# Altium schematic sheet 1050.SchDoc
size A3
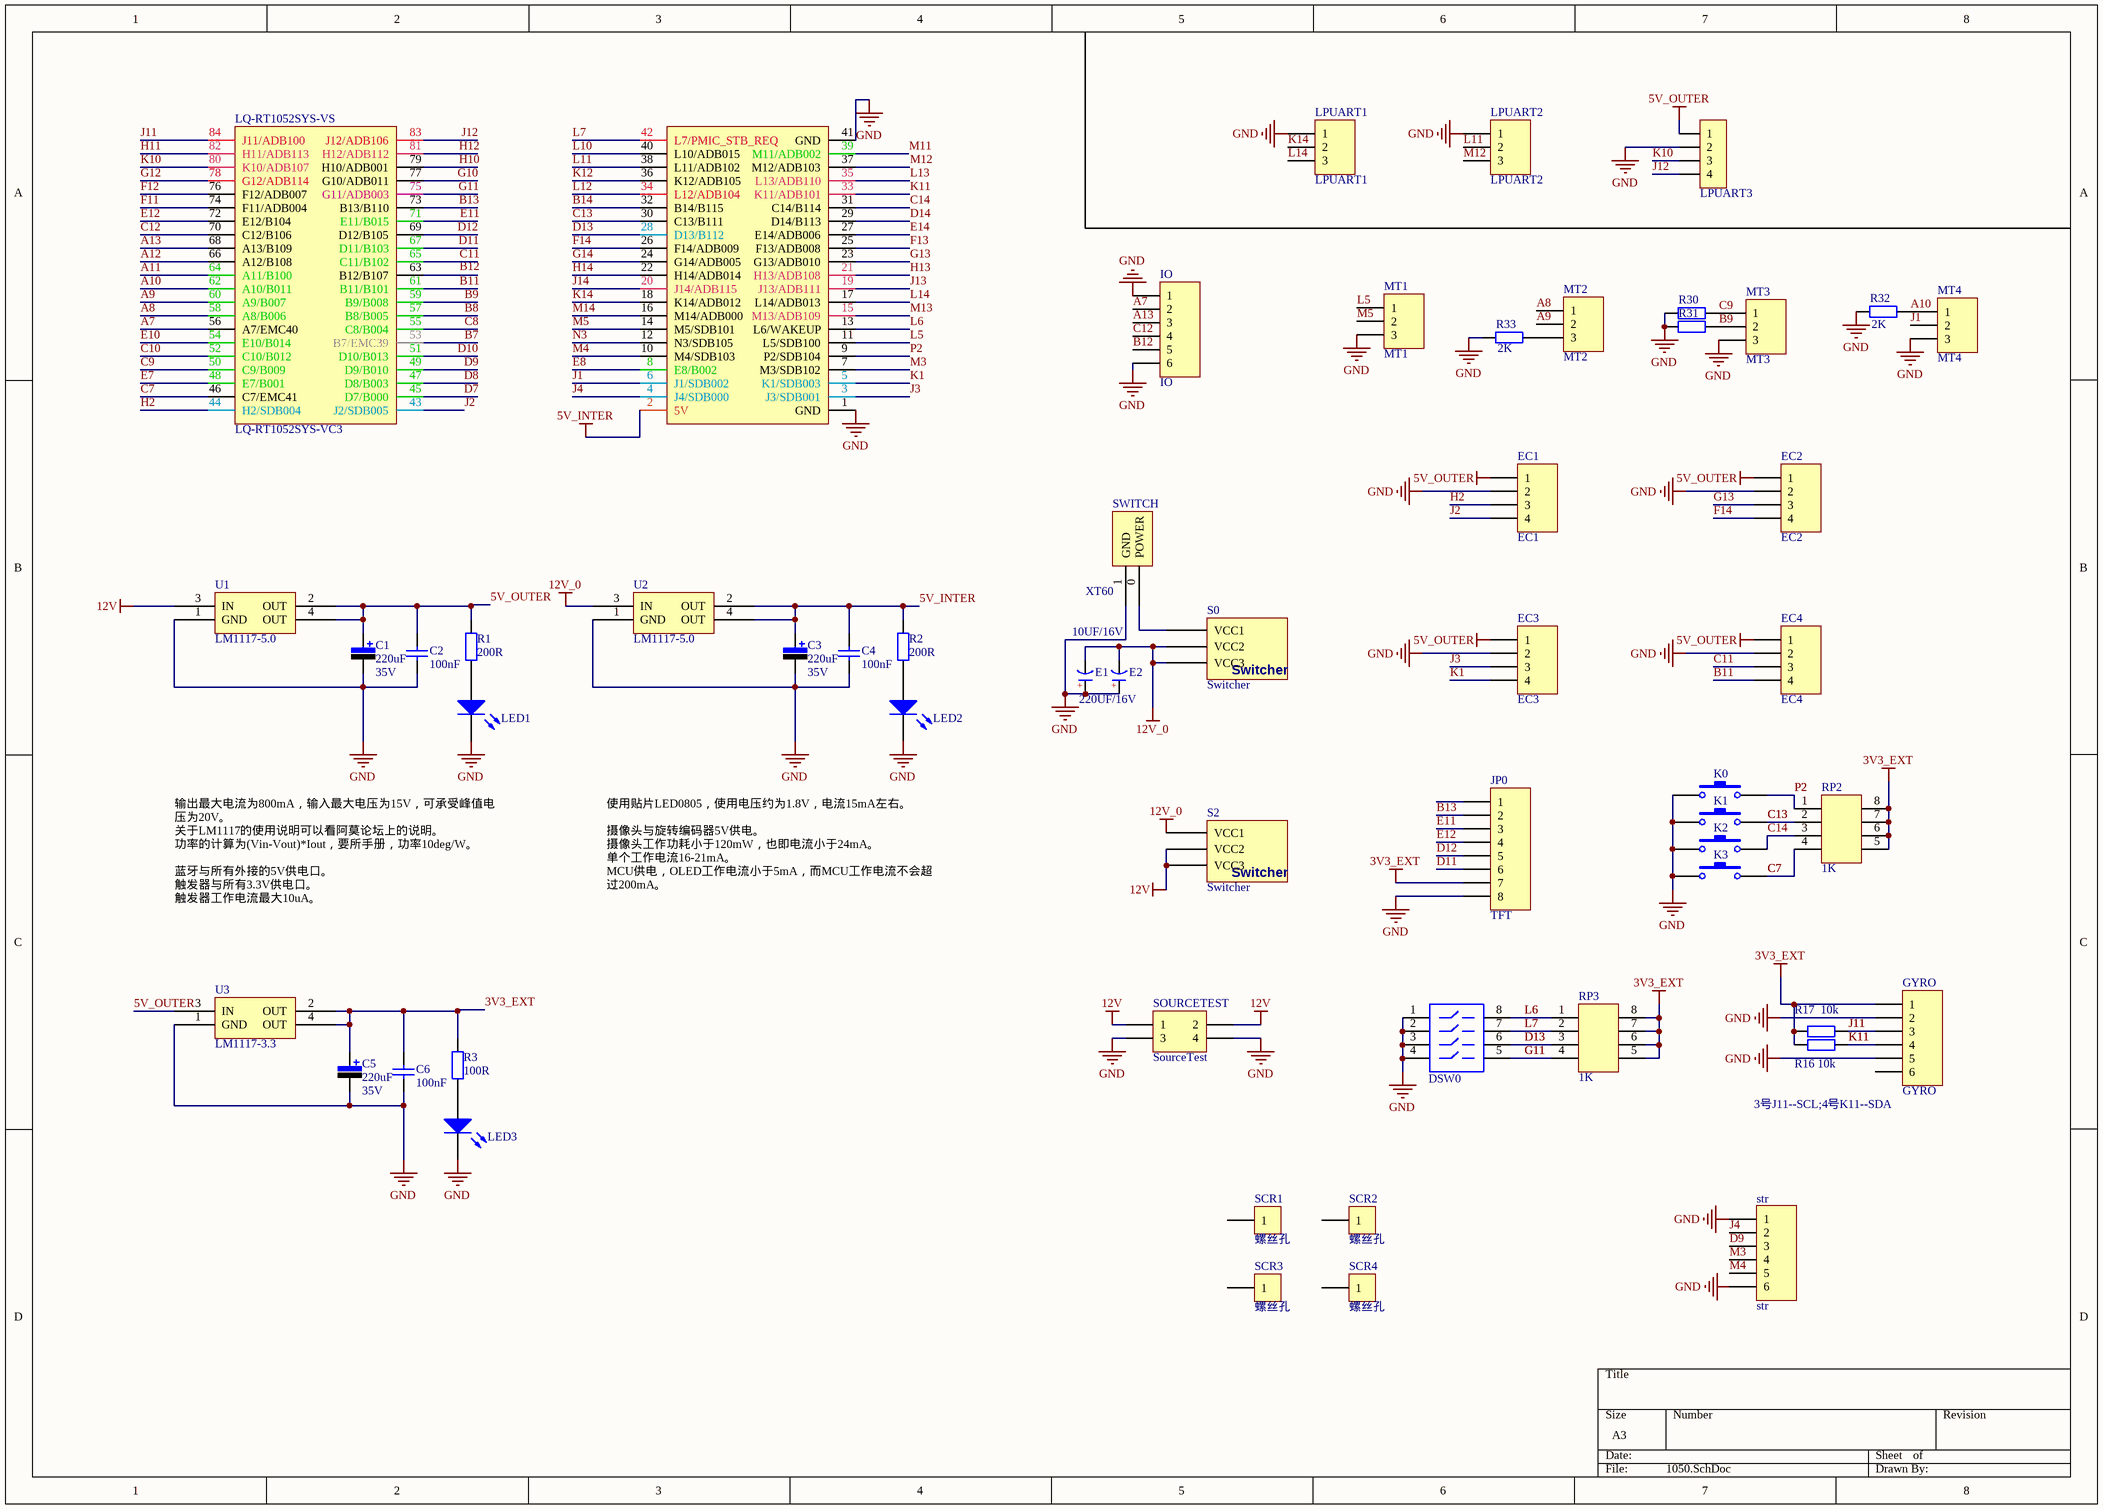
[diagram p0: 1050.SchDoc]

## Parts
C1  value 220uF  Vol: 35V  [CAP-7343]  (hidden comment: Cap Pol)
C2  value 100nF  [C 0805]  (hidden comment: Cap)
C3  value 220uF  Vol: 35V  [CAP-7343]  (hidden comment: Cap Pol)
C4  value 100nF  [C 0805]  (hidden comment: Cap)
C5  value 220uF  Vol: 35V  [CAP-7343]  (hidden comment: Cap Pol)
C6  value 100nF  [C 0805]  (hidden comment: Cap)
DSW0  SW-DIP4  [LQ_DIP-4-KEY]  (value not drawn)
E1  220UF/16V  [CAPR5-4X5]
E2  10UF/16V  [CAPR5-4X5]
EC1  EC1  [HDR1X4]
EC2  EC2  [HDR1X4]
EC3  EC3  [HDR1X4]
EC4  EC4  [HDR1X4]
GYRO  GYRO  [HDR1X6]
IO  IO  [XH2.54-6P_H]
JP0  TFT  [HDR1X8]
K0  微动开关  [surface_key]  (value not drawn)
K1  微动开关  [surface_key]  (value not drawn)
K2  微动开关  [surface_key]  (value not drawn)
K3  微动开关  [surface_key]  (value not drawn)
LED1  LED0  [LED_0805]  (value not drawn)
LED2  LED0  [LED_0805]  (value not drawn)
LED3  LED0  [LED_0805]  (value not drawn)
LPUART1  LPUART1  [HDR1X3]
LPUART2  LPUART2  [HDR1X3]
LPUART3  HDR-1X4  [HDR1X4]  (value not drawn)
LQ-RT1052SYS-VS  LQ-RT1052SYS-VC3  [LQ-RT1052SYS-VC3]
MT1  MT1  [XH2.54-3P_H]
MT2  MT2  [XH2.54-3P_H]
MT3  MT3  [XH2.54-3P_H]
MT4  MT4  [XH2.54-3P_H]
R1  value 200R  [R 0805]  (hidden comment: Res1)
R2  value 200R  [R 0805]  (hidden comment: Res1)
R3  value 100R  [R 0805]  (hidden comment: Res1)
R16_10k  Res1  [R 0805]  (value not drawn)
R17_10k  Res1  [R 0805]  (value not drawn)
R30  Res1  [R 0805]  (value not drawn)
R31  Res1  [R 0805]  (value not drawn)
R32  value 2K  [R 0805]  (hidden comment: Res1)
R33  value 2K  [R 0805]  (hidden comment: Res1)
RP2  1K  [LQ_RP4-0603]
RP3  1K  [LQ_RP4-0603]
S0  Switcher  [ThreeSwitcher]
S2  Switcher  [ThreeSwitcher]
SCR1  螺丝孔  [LQ_SCROW3&5mm]
SCR2  螺丝孔  [LQ_SCROW3&5mm]
SCR3  螺丝孔  [LQ_SCROW3&5mm]
SCR4  螺丝孔  [LQ_SCROW3&5mm]
SOURCETEST  SourceTest  [MHDR2X2]
str  str  [XH2.54-6P_H]
SWITCH  XT60  [XT60]
U1  LM1117-5.0  [SOT-223]
U2  LM1117-5.0  [SOT-223]
U3  LM1117-3.3  [SOT-223]

## Nets
3V3_EXT: C5.1 C6.2 GYRO.1 JP0.7 R3.2 R16_10k.2 R17_10k.2 RP2.5 RP2.6 RP2.7 RP2.8 RP3.5 RP3.6 RP3.7 RP3.8 U3.2(OUT) U3.4(OUT)
5V_INTER: C3.1 C4.2 LQ-RT1052SYS-VS.2(5V) R2.2 U2.2(OUT) U2.4(OUT)
5V_OUTER: C1.1 C2.2 EC1.1 EC2.1 EC3.1 EC4.1 LPUART3.1 R1.2 U1.2(OUT) U1.4(OUT) U3.3(IN)
12V: S2.VCC2 S2.VCC3 SOURCETEST.1 SOURCETEST.2 U1.3(IN)
12V_0: E1.2(K) E2.2(K) S0.VCC2 S0.VCC3 S2.VCC1 U2.3(IN)
GND: C1.2 C2.1 C3.2 C4.1 C5.2 C6.1 DSW0.1 DSW0.2 DSW0.3 DSW0.4 E1.1(A) E2.1(A) EC1.2 EC2.2 EC3.2 EC4.2 GYRO.2 GYRO.5 IO.1 IO.6 JP0.8 K0.1 K1.1 K2.1 K3.1 LED1.2(K) LED2.2(K) LED3.2(K) LPUART1.1 LPUART2.1 LPUART3.2 LQ-RT1052SYS-VS.1(GND) LQ-RT1052SYS-VS.41(GND) MT1.3 MT3.3 MT4.3 R30.2 R31.2 R32.2 R33.2 SOURCETEST.3 SOURCETEST.4 str.1 SWITCH.1(GND) U1.1(GND) U2.1(GND) U3.1(GND)
A7: IO.2 LQ-RT1052SYS-VS.56(A7/EMC40)
A8: LQ-RT1052SYS-VS.58(A8/B006) MT2.1
A9: LQ-RT1052SYS-VS.60(A9/B007) MT2.2
A10: LQ-RT1052SYS-VS.62(A10/B011) MT4.1 R32.1
A11: LQ-RT1052SYS-VS.64(A11/B100)
A12: LQ-RT1052SYS-VS.66(A12/B108)
A13: IO.3 LQ-RT1052SYS-VS.68(A13/B109)
B7: LQ-RT1052SYS-VS.53(B7/EMC39)
B8: LQ-RT1052SYS-VS.57(B8/B005)
B9: LQ-RT1052SYS-VS.59(B9/B008) MT3.2 R31.1
B11: EC4.4 LQ-RT1052SYS-VS.61(B11/B101)
B12: IO.5
B13: JP0.2 LQ-RT1052SYS-VS.73(B13/B110)
B14: LQ-RT1052SYS-VS.32(B14/B115)
C7: K3.2 LQ-RT1052SYS-VS.46(C7/EMC41) RP2.4
C8: LQ-RT1052SYS-VS.55(C8/B004)
C9: LQ-RT1052SYS-VS.50(C9/B009) MT3.1 R30.1
C10: LQ-RT1052SYS-VS.52(C10/B012)
C11: EC4.3 LQ-RT1052SYS-VS.65(C11/B102)
C12: IO.4 LQ-RT1052SYS-VS.70(C12/B106)
C13: K1.2 LQ-RT1052SYS-VS.30(C13/B111) RP2.2
C14: K2.2 LQ-RT1052SYS-VS.31(C14/B114) RP2.3
D7: LQ-RT1052SYS-VS.45(D7/B000)
D8: LQ-RT1052SYS-VS.47(D8/B003)
D9: LQ-RT1052SYS-VS.49(D9/B010) str.3
D10: LQ-RT1052SYS-VS.51(D10/B013)
D11: JP0.6 LQ-RT1052SYS-VS.67(D11/B103)
D12: JP0.5 LQ-RT1052SYS-VS.69(D12/B105)
D13: DSW0.6 LQ-RT1052SYS-VS.28(D13/B112) RP3.3
D14: LQ-RT1052SYS-VS.29(D14/B113)
E7: LQ-RT1052SYS-VS.48(E7/B001)
E8: LQ-RT1052SYS-VS.8(E8/B002)
E10: LQ-RT1052SYS-VS.54(E10/B014)
E11: JP0.3 LQ-RT1052SYS-VS.71(E11/B015)
E12: JP0.4 LQ-RT1052SYS-VS.72(E12/B104)
E14: LQ-RT1052SYS-VS.27(E14/ADB006)
F11: LQ-RT1052SYS-VS.74(F11/ADB004)
F12: LQ-RT1052SYS-VS.76(F12/ADB007)
F13: LQ-RT1052SYS-VS.25(F13/ADB008)
F14: EC2.4 LQ-RT1052SYS-VS.26(F14/ADB009)
G10: LQ-RT1052SYS-VS.77(G10/ADB011)
G11: DSW0.5 LQ-RT1052SYS-VS.75(G11/ADB003) RP3.4
G12: LQ-RT1052SYS-VS.78(G12/ADB114)
G13: EC2.3 LQ-RT1052SYS-VS.23(G13/ADB010)
G14: LQ-RT1052SYS-VS.24(G14/ADB005)
H2: EC1.3 LQ-RT1052SYS-VS.44(H2/SDB004)
H10: LQ-RT1052SYS-VS.79(H10/ADB001)
H11: LQ-RT1052SYS-VS.82(H11/ADB113)
H12: LQ-RT1052SYS-VS.81(H12/ADB112)
H13: LQ-RT1052SYS-VS.21(H13/ADB108)
H14: LQ-RT1052SYS-VS.22(H14/ADB014)
J1: LQ-RT1052SYS-VS.6(J1/SDB002) MT4.2
J2: EC1.4 LQ-RT1052SYS-VS.43(J2/SDB005)
J3: EC3.3 LQ-RT1052SYS-VS.3(J3/SDB001)
J4: LQ-RT1052SYS-VS.4(J4/SDB000) str.2
J11: GYRO.3 LQ-RT1052SYS-VS.84(J11/ADB100) R17_10k.1
J12: LPUART3.4 LQ-RT1052SYS-VS.83(J12/ADB106)
J13: LQ-RT1052SYS-VS.19(J13/ADB111)
J14: LQ-RT1052SYS-VS.20(J14/ADB115)
K1: EC3.4 LQ-RT1052SYS-VS.5(K1/SDB003)
K10: LPUART3.3 LQ-RT1052SYS-VS.80(K10/ADB107)
K11: GYRO.4 LQ-RT1052SYS-VS.33(K11/ADB101) R16_10k.1
K12: LQ-RT1052SYS-VS.36(K12/ADB105)
K14: LPUART1.2 LQ-RT1052SYS-VS.18(K14/ADB012)
L5: LQ-RT1052SYS-VS.11(L5/SDB100) MT1.1
L6: DSW0.8 LQ-RT1052SYS-VS.13(L6/WAKEUP) RP3.1
L7: DSW0.7 LQ-RT1052SYS-VS.42(L7/PMIC_STB_REQ) RP3.2
L10: LQ-RT1052SYS-VS.40(L10/ADB015)
L11: LPUART2.2 LQ-RT1052SYS-VS.38(L11/ADB102)
L12: LQ-RT1052SYS-VS.34(L12/ADB104)
L13: LQ-RT1052SYS-VS.35(L13/ADB110)
L14: LPUART1.3 LQ-RT1052SYS-VS.17(L14/ADB013)
M3: LQ-RT1052SYS-VS.7(M3/SDB102) str.4
M4: LQ-RT1052SYS-VS.10(M4/SDB103) str.5
M5: LQ-RT1052SYS-VS.14(M5/SDB101) MT1.2
M11: LQ-RT1052SYS-VS.39(M11/ADB002)
M12: LPUART2.3 LQ-RT1052SYS-VS.37(M12/ADB103)
M13: LQ-RT1052SYS-VS.15(M13/ADB109)
M14: LQ-RT1052SYS-VS.16(M14/ADB000)
N3: LQ-RT1052SYS-VS.12(N3/SDB105)
P2: K0.2 LQ-RT1052SYS-VS.9(P2/SDB104) RP2.1
NetLED1_1: LED1.1(A) R1.1
NetLED2_1: LED2.1(A) R2.1
NetLED3_1: LED3.1(A) R3.1
NetMT2_3: MT2.3 R33.1
NetS0_VCC1: S0.VCC1 SWITCH.0(POWER)

Not connected (* = marked no-connect by the designer): GYRO 6; JP0 1; LQ-RT1052SYS-VS 63(B12/B107); SCR1 1; SCR2 1; SCR3 1; SCR4 1; str 6

## Notes on the sheet
- 输出最大电流为800mA，输入最大电压为15V，可承受峰值电压为20V。
  关于LM1117的使用说明可以看阿莫论坛上的说明。
  功率的计算为(Vin-Vout)*Iout，要所手册，功率10deg/W。
- 使用贴片LED0805，使用电压约为1.8V，电流15mA左右。
- 蓝牙与所有外接的5V供电口。
  触发器与所有3.3V供电口。
  触发器工作电流最大10uA。
- 摄像头与旋转编码器5V供电。
  摄像头工作功耗小于120mW，也即电流小于24mA。
  单个工作电流16-21mA。
  MCU供电，OLED工作电流小于5mA，而MCU工作电流不会超过200mA。
- 3号J11--SCL;4号K11--SDA
- Labels drawn without touching a wire or pin: B12, GND
- (in symbol C-CAP) +

## Library data of the parts
C1 C3 C5 = Cap Pol: 极性电解电容; Published: 8-Jun-2000; LatestRevisionDate: 17-Jul-2002; LatestRevisionNote: Re-released for DXP Platform.; PackageReference: RB7.6-15; Publisher: Altium Limited
C2 C4 C6 = Cap: 无极性电容; Published: 8-Jun-2000; LatestRevisionDate: 17-Jul-2002; LatestRevisionNote: Re-released for DXP Platform.; PackageReference: RAD-0.3; Publisher: Altium Limited
E1 E2 = C-CAP: 直插电解电容; 版权归属: 黎明电子style; BOM名称: 直插电解电容; 学习资源: https://lmdzstyle.taobao.com/
EC1-EC4 = Header 4: Header, 4-Pin; LatestRevisionDate: 17-Jul-2002; LatestRevisionNote: Re-released for DXP Platform.; Publisher: Altium Limited
GYRO = Header 6: Header, 6-Pin; LatestRevisionDate: 17-Jul-2002; LatestRevisionNote: Re-released for DXP Platform.; Publisher: Altium Limited
IO str = MHDR1X6: Header, 6-Pin; LatestRevisionDate: 17-Jul-2002; LatestRevisionNote: Re-released for DXP Platform.; Publisher: Altium Limited
JP0 = Header 8: Header, 8-Pin; LatestRevisionDate: 17-Jul-2002; LatestRevisionNote: Re-released for DXP Platform.; Publisher: Altium Limited
LED1-LED3 = LED0: 发光二极管; Published: 8-Jun-2000; LatestRevisionDate: 08-Jul-2005; LatestRevisionNote: Mech Layer 1 removed.; PackageReference: LED-0; Publisher: Altium Limited
LPUART1 LPUART2 MT1-MT4 = Header 3: Header, 3-Pin; LatestRevisionDate: 17-Jul-2002; LatestRevisionNote: Re-released for DXP Platform.; Publisher: Altium Limited
LPUART3 = Header 4: 4P接插件; 版权归属: 黎明电子style; BOM名称: 4P接插件; 学习资源: https://lmdzstyle.taobao.com/
R1-R3 R16_10k R17_10k R30-R33 = Res1: 贴片电阻; Published: 8-Jun-2000; LatestRevisionDate: 17-Jul-2002; LatestRevisionNote: Re-released for DXP Platform.; PackageReference: AXIAL-0.4; Publisher: Altium Limited
RP2 RP3 = B型贴片阻排—8
S0 S2 = 3_Switcher: pin to pad: VCC1>1 VCC2>2 VCC3>3
SCR1-SCR4 = CON1: Connector
SOURCETEST = Header 2X2: Header, 2-Pin, Dual row; LatestRevisionDate: 17-Jul-2002; LatestRevisionNote: Re-released for DXP Platform.; Publisher: Altium Limited
U1 U2 = SPX1117M3-5.0: 5.0V稳压芯片
U3 = ASM1117: 3.3V稳压芯片